# EAGLE schematic power_supply (EAGLE 9.6.2)
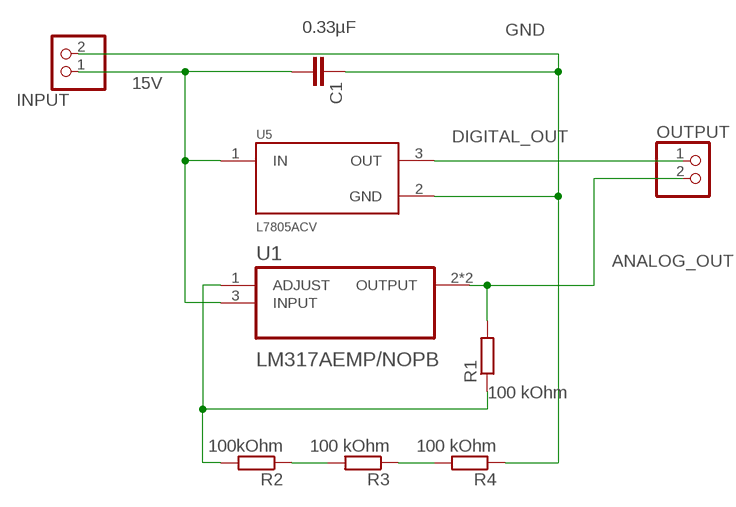
[diagram p0: schematic, sheet 1]

## Parts
C1  0.33µF  C-EUC0805  [C0805]
INPUT  PINHD-1X2  [1X02]
OUTPUT  PINHD-1X2  [1X02]
R1  100 kOhm  R-EU_R0805  [R0805]
R2  100kOhm  R-EU_R0805  [R0805]
R3  100 kOhm  R-EU_R0805  [R0805]
R4  100 kOhm  R-EU_R0805  [R0805]
U1  LM317AEMP/NOPB  [SOT230P700X180-4N]
U5  L7805ACV  [TO254P460X1020X1945-3P]

## Nets
15V: C1.2 INPUT.1 U1.3(INPUT) U5.1(IN)
ANALOG_OUT: OUTPUT.2 R1.2 U1.2(OUTPUT) U1.4(OUTPUT)
DIGITAL_OUT: OUTPUT.1 U5.3(OUT)
GND: C1.1 INPUT.2 R4.1 U5.2(GND)
N$1: R1.1 R2.2 U1.1(ADJUST)
N$2: R2.1 R3.2
N$3: R3.1 R4.2

## Library data of the parts
C1 = rcl:C-EU: CAPACITOR, European symbol; SPICEPREFIX: C
INPUT OUTPUT = pinhead:PINHD-1X2: PIN HEADER
R1-R4 = rcl:R-EU_: RESISTOR, European symbol; SPICEPREFIX: R
U1 = LM317AEMP_NOPB:LM317AEMP/NOPB: Check prices <https://pricing.snapeda.com/parts/LM317AEMP/NOPB/Texas%20Instruments/view-part?ref=eda>; AVAILABILITY: Good; DESCRIPTION: 1.5-A, 40-V, adjustable linear voltage regulator with high-accuracy 4-SOT-223 -40 to 125; MF: Texas Instruments; MP: LM317AEMP/NOPB; PACKAGE: SOT-223-4 Texas Instruments; PRICE: None; PURCHASE-URL: https://pricing.snapeda.com/search/part/LM317AEMP/NOPB/?ref=eda
U5 = L7805ACV:L7805ACV: L7805 Series 1.5 A 5 V Three Terminal Voltage Regulator - TO-220 Check prices <https://pricing.snapeda.com/parts/L7805ACV/STMicroelectronics/view-part?ref=eda>; AVAILABILITY: Good; DESCRIPTION: Linear Voltage Regulator IC Positive Fixed 1 Output 1.5A TO-220; MF: STMicroelectronics; MP: L7805ACV; PACKAGE: TO-220-3 ON Semiconductor; PRICE: None; PURCHASE-URL: https://pricing.snapeda.com/search/part/L7805ACV/?ref=eda